# Altium schematic sheet hv_mux_tr_sw.SchDoc: BioGAP WULPUS-pro shield
size A3; DrawnBy: IIS; Revision: 1.0.0; SheetNumber: 5; SheetTotal: 8
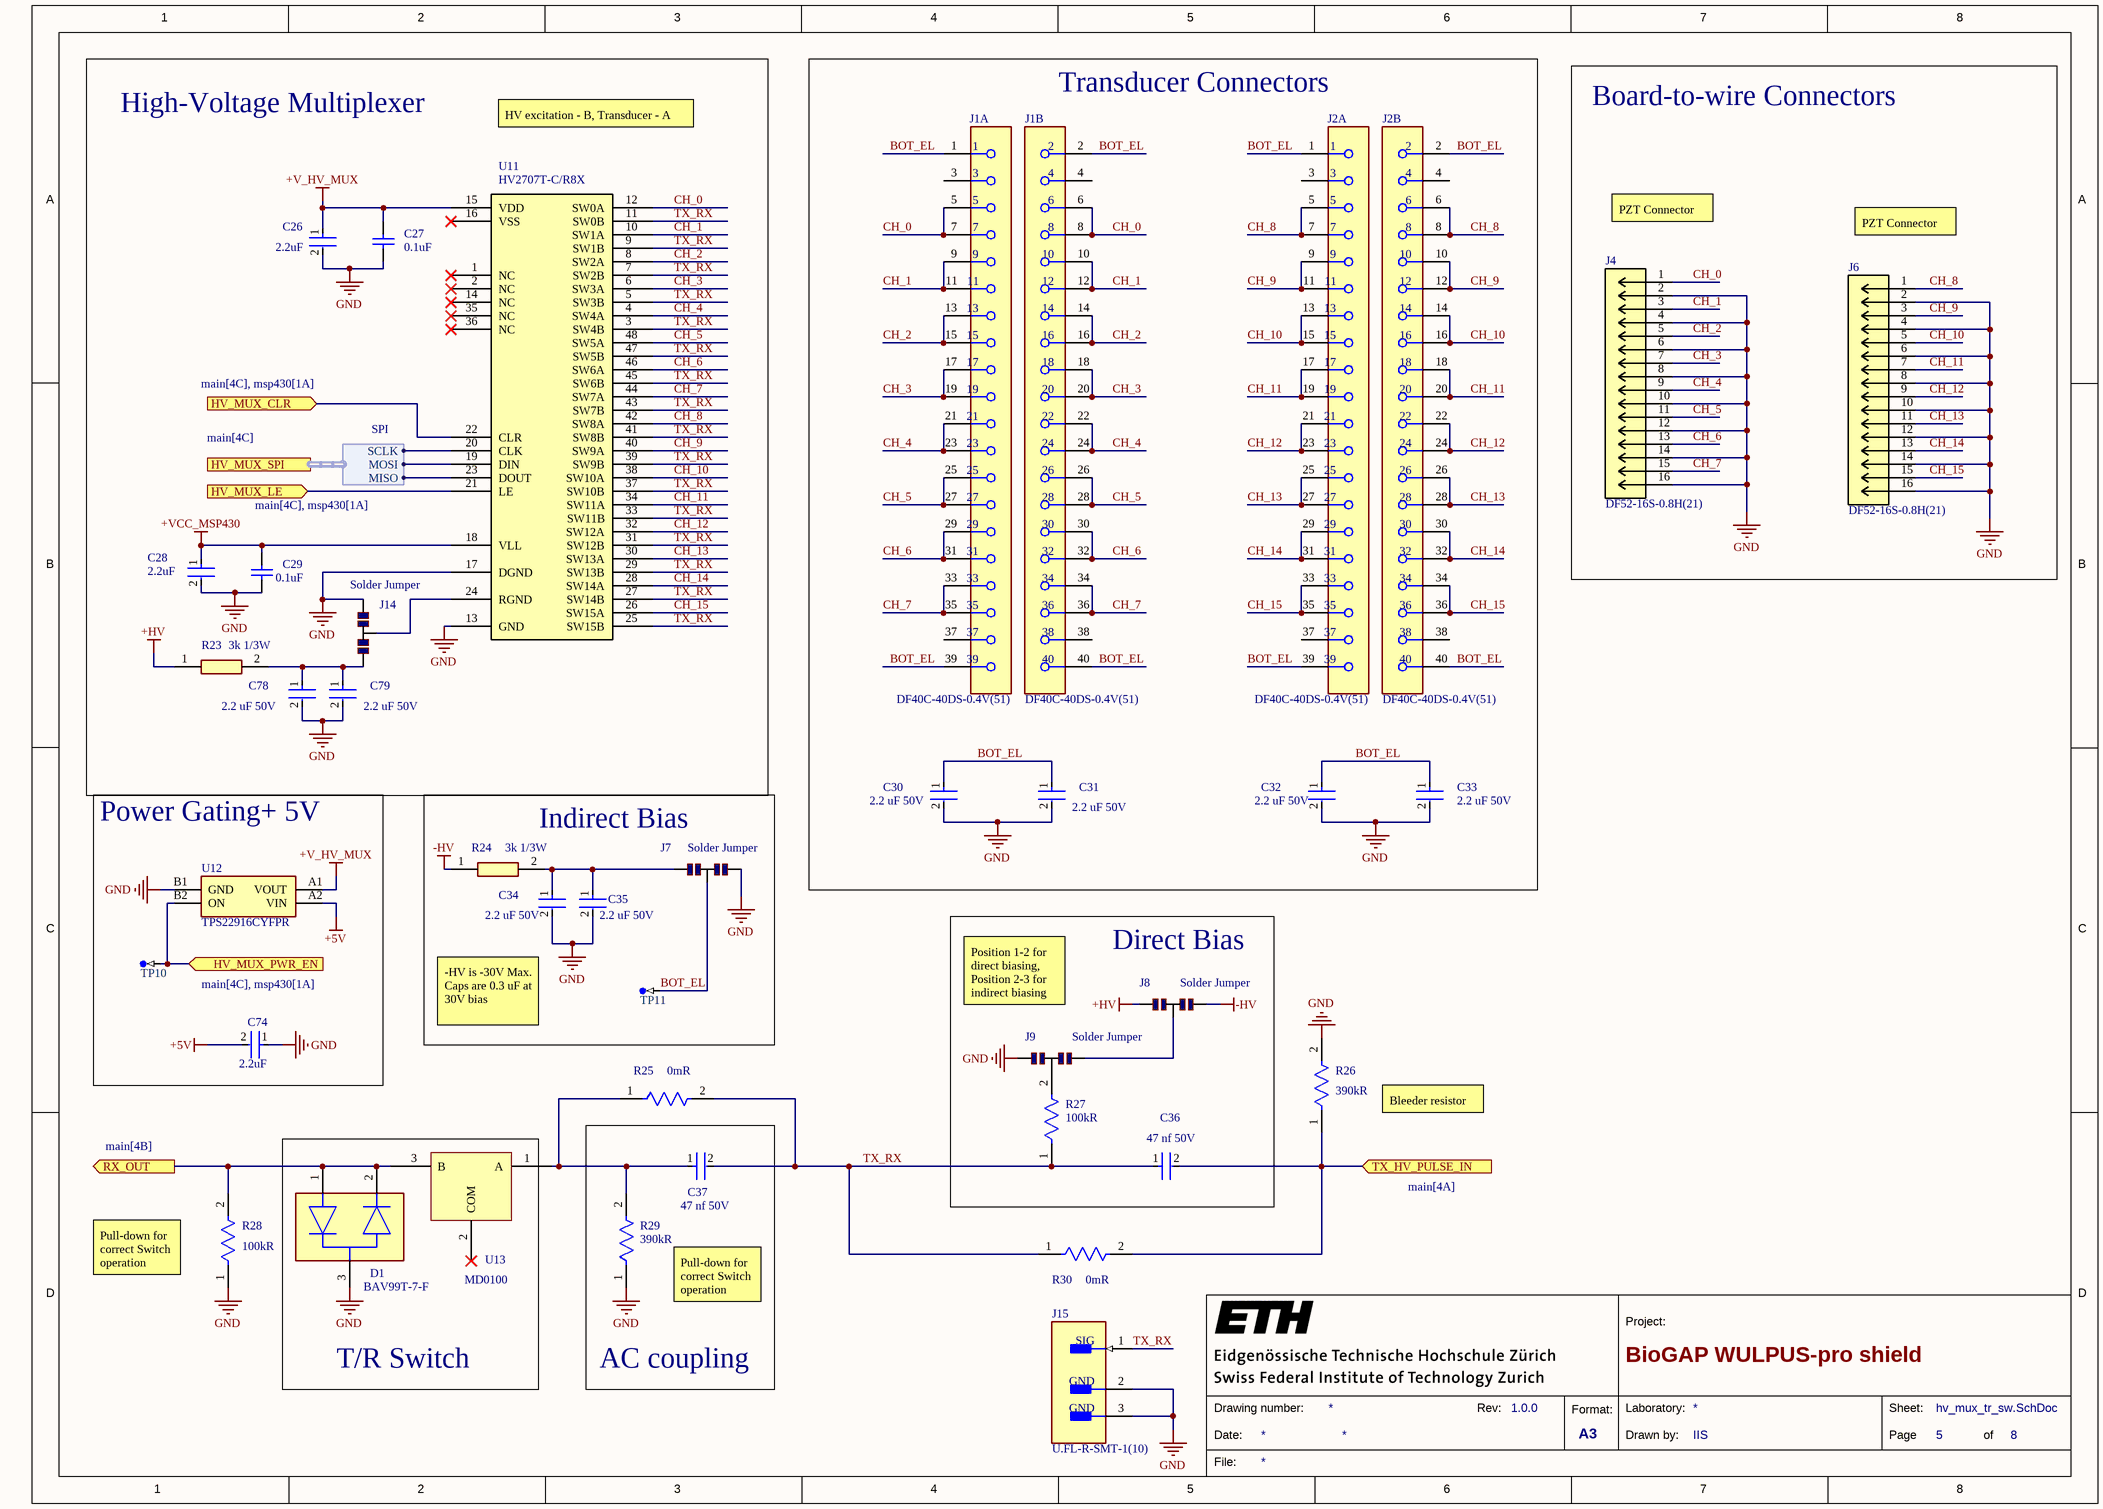
[diagram p0: hv_mux_tr_sw.SchDoc]

## Parts
C26  Capacitance: 2.2uF  [FP-C1005-050-0_15-0_1-MFG]  (hidden comment: C1005X7S1A225K050BC)
C27  Capacitance: 0.1uF  [CAPC1005X55X30LL05T10]  (hidden comment: C0402C104K4RACTU)
C28  Capacitance: 2.2uF  [FP-C1005-050-0_15-0_1-MFG]  (hidden comment: C1005X7S1A225K050BC)
C29  Capacitance: 0.1uF  [CAPC1005X55X30LL05T10]  (hidden comment: C0402C104K4RACTU)
C30  Capacitance: 2.2 uF 50V  [FP-GRM188-0_2-IPC_B]  (hidden comment: GRM188R61H225ME11)
C31  Capacitance: 2.2 uF 50V  [FP-GRM188-0_2-IPC_B]  (hidden comment: GRM188R61H225ME11)
C32  Capacitance: 2.2 uF 50V  [FP-GRM188-0_2-IPC_B]  (hidden comment: GRM188R61H225ME11)
C33  Capacitance: 2.2 uF 50V  [FP-GRM188-0_2-IPC_B]  (hidden comment: GRM188R61H225ME11)
C34  Capacitance: 2.2 uF 50V  [FP-GRM188-0_2-IPC_B]  (hidden comment: GRM188R61H225ME11)
C35  Capacitance: 2.2 uF 50V  [FP-GRM188-0_2-IPC_B]  (hidden comment: GRM188R61H225ME11)
C36  Capacitance: 47 nf 50V  [FP-GRM155-0_05-IPC_C]  (hidden comment: GRM155R71H473ME14D)
C37  Capacitance: 47 nf 50V  [FP-GRM155-0_05-IPC_C]  (hidden comment: GRM155R71H473ME14D)
C74  Capacitance: 2.2uF  [FP-C1005-050-0_15-0_1-MFG]  (hidden comment: C1005X7S1A225K050BC)
C78  Capacitance: 2.2 uF 50V  [FP-GRM188-0_2-IPC_B]  (hidden comment: GRM188R61H225ME11)
C79  Capacitance: 2.2 uF 50V  [FP-GRM188-0_2-IPC_B]  (hidden comment: GRM188R61H225ME11)
D1  BAV99T-7-F  [FP-SOT523-MFG]
J1  DF40C-40DS-0.4V(51)  [FP-DF40C-40DS-0_4V_51-MFG]  (parts A,B of 2)
J2  DF40C-40DS-0.4V(51)  [FP-DF40C-40DS-0_4V_51-MFG]  (parts A,B of 2)
J4  DF52-16S-0.8H(21)  [CONN_DF52-16S-0.8H(21)_HIR]
J6  DF52-16S-0.8H(21)  [CONN_DF52-16S-0.8H(21)_HIR]
J7  Solder Jumper  [Jumper 3 pins]  (no BOM)
J8  Solder Jumper  [Jumper 3 pins]  (no BOM)
J9  Solder Jumper  [Jumper 3 pins]  (no BOM)
J14  Solder Jumper  [Jumper 3 pins]  (no BOM)
J15  U.FL-R-SMT-1(10)  [FP-U_FL-R-SMT-1_10-MFG]
R23  Res: 3k 1/3W  [ERJP03_PA3_(0603)]  (hidden comment: ERJ-PA3J302V)
R24  Res: 3k 1/3W  [ERJP03_PA3_(0603)]  (hidden comment: ERJ-PA3J302V)
R25  Resistance: 0mR  [FP-CRCW0402-e3-IPC_C]  (hidden comment: CRCW04020000Z0ED)
R26  Resistance: 390kR  [FP-RC1005-MFG]  (hidden comment: RC1005F394CS)
R27  Resistance: 100kR  [FP-ERJ2RK-IPC_C]  (hidden comment: ERJ-2RKF1003X)
R28  Resistance: 100kR  [FP-ERJ2RK-IPC_C]  (hidden comment: ERJ-2RKF1003X)
R29  Resistance: 390kR  [FP-RC1005-MFG]  (hidden comment: RC1005F394CS)
R30  Resistance: 0mR  [FP-CRCW0402-e3-IPC_C]  (hidden comment: CRCW04020000Z0ED)
TP10  TP-SM-C-100  [TP-SM-C-100]  (value not drawn)  (no BOM)
TP11  TP-SM-C-100  [TP-SM-C-100]  (value not drawn)  (no BOM)
U11  HV2707T-C/R8X  [LQFP48_7X7MC_MCH]
U12  TPS22916CYFPR  [BGA4C40P2X2_78X78X50]
U13  MD0100  [AMP_PHA-1+]

## Blocks framed on the sheet
High-Voltage Multiplexer: C26-C29 C78 C79 J14 R23 U11
Transducer Connectors: C30-C33 J1 J2
Board-to-wire Connectors: J4 J6
Power Gating+ 5V: C74 TP10 U12
Indirect Bias: C34 C35 J7 R24 TP11
Direct Bias: C36 J8 J9 R27
T/R Switch: D1 U13
AC coupling: C37 R29

## Ports
HV_MUX_CLR (in, see main[4C], msp430[1A]), HV_MUX_LE (in, see main[4C], msp430[1A]), HV_MUX_PWR_EN (in, see main[4C], msp430[1A]), HV_MUX_SPI (harness SPI, see main[4C]), RX_OUT (out, see main[4B]), TX_HV_PULSE_IN (in, see main[4A])

## Harnesses
SPI: SCLK, MOSI, MISO

## Nets
+5V: C74.2 U12.A2(VIN)
+HV: J8.1 R23.1
+V_HV_MUX: C26.1 C27.2 U11.15(VDD) U12.A1(VOUT)
+VCC_MSP430: C28.1 C29.2 U11.18(VLL)
-HV: J8.3 R24.1
GND: C26.2 C27.1 C28.2 C29.1 C30.2 C31.2 C32.2 C33.2 C34.2 C35.2 C74.1 C78.2 C79.2 D1.3 J4.2 J4.4 J4.6 J4.8 J4.10 J4.12 J4.14 J4.16 J6.2 J6.4 J6.6 J6.8 J6.10 J6.12 J6.14 J6.16 J7.3 J9.1 J14.3 J15.2(GND) J15.3(GND) R26.2 R28.1 R29.1 U11.13(GND) U11.17(DGND) U12.B1(GND)
BOT_EL: C30.1 C31.1 C32.1 C33.1 J1.1 J1.2 J1.39 J1.40 J2.1 J2.2 J2.39 J2.40 J7.2 TP11.1
CH_0: J1.5 J1.6 J1.7 J1.8 J4.1 U11.12(SW0A)
CH_1: J1.9 J1.10 J1.11 J1.12 J4.3 U11.10(SW1A)
CH_2: J1.13 J1.14 J1.15 J1.16 J4.5 U11.8(SW2A)
CH_3: J1.17 J1.18 J1.19 J1.20 J4.7 U11.6(SW3A)
CH_4: J1.21 J1.22 J1.23 J1.24 J4.9 U11.4(SW4A)
CH_5: J1.25 J1.26 J1.27 J1.28 J4.11 U11.48(SW5A)
CH_6: J1.29 J1.30 J1.31 J1.32 J4.13 U11.46(SW6A)
CH_7: J1.33 J1.34 J1.35 J1.36 J4.15 U11.44(SW7A)
CH_8: J2.5 J2.6 J2.7 J2.8 J6.1 U11.42(SW8A)
CH_9: J2.9 J2.10 J2.11 J2.12 J6.3 U11.40(SW9A)
CH_10: J2.13 J2.14 J2.15 J2.16 J6.5 U11.38(SW10A)
CH_11: J2.17 J2.18 J2.19 J2.20 J6.7 U11.34(SW11A)
CH_12: J2.21 J2.22 J2.23 J2.24 J6.9 U11.32(SW12A)
CH_13: J2.25 J2.26 J2.27 J2.28 J6.11 U11.30(SW13A)
CH_14: J2.29 J2.30 J2.31 J2.32 J6.13 U11.28(SW14A)
CH_15: J2.33 J2.34 J2.35 J2.36 J6.15 U11.26(SW15A)
HV_MUX_CLR: U11.22(CLR) ; port HV_MUX_CLR
HV_MUX_LE: U11.21(LE) ; port HV_MUX_LE
HV_MUX_PWR_EN: TP10.1 U12.B2(ON) ; port HV_MUX_PWR_EN
RX_OUT: D1.1 D1.2 R28.2 U13.3(B) ; port RX_OUT
TX_HV_PULSE_IN: C36.2 R26.1 R30.2 ; port TX_HV_PULSE_IN
TX_RX: C36.1 C37.2 J15.1(SIG) R25.2 R27.1 R30.1 U11.3(SW4B) U11.5(SW3B) U11.7(SW2B) U11.9(SW1B) U11.11(SW0B) U11.25(SW15B) U11.27(SW14B) U11.29(SW13B) U11.31(SW12B) U11.33(SW11B) U11.37(SW10B) U11.39(SW9B) U11.41(SW8B) U11.43(SW7B) U11.45(SW6B) U11.47(SW5B)
NetC34_1: C34.1 C35.1 J7.1 R24.2
NetC37_1: C37.1 R25.1 R29.2 U13.1(A)
NetC78_1: C78.1 C79.1 J14.1 R23.2
NetJ8_2: J8.2 J9.3
NetJ9_2: J9.2 R27.2
NetJ14_2: J14.2 U11.24(RGND)
NetU11_19: U11.19(DIN) ; port HV_MUX_SPI.MOSI
NetU11_20: U11.20(CLK) ; port HV_MUX_SPI.SCLK
NetU11_23: U11.23(DOUT) ; port HV_MUX_SPI.MISO

Not connected (* = marked no-connect by the designer): J1 3 4 37 38; J2 3 4 37 38; U11 1(NC)* 2(NC)* 14(NC)* 16(VSS)* 35(NC)* 36(NC)*; U13 2(COM)*

## Notes on the sheet
- HV excitation - B, Transducer - A
- PZT Connector
- -HV is -30V Max. Caps are 0.3 uF at 30V bias
- Position 1-2 for direct biasing, Position 2-3 for indirect biasing
- Bleeder resistor
- (near R28) Pull-down for correct Switch operation
- (near R29) Pull-down for correct Switch operation
- 1
- 2
- 3
- 4
- 5
- 6
- 7
- 8
- A
- B
- C
- D
- Project:
- Date:
- Drawing number:
- Rev:
- Format:
- A3
- Drawn by:
- Laboratory:
- Page
- Sheet:
- of
- File:

## Library data of the parts
C26 C28 C74 = CMP-08246-004344-1: Dielectric: X7S; Dielectric Material: Ceramic; Voltage Rating: 10V; Tolerance: 10%; Mount: Surface Mount; Height: 0.5mm; Package Quantity: 1; Depth: 0.5mm; RoHS Compliant: Yes; Length: 1mm; Thickness: 0.022inch; Packaging: Tape and Reel; Case Code (Imperial): 0402; Resistor Type: Ceramic; Case/Package: 0402; Min Operating Temperature: -55°C; Series: C; Weight: 2.3E-05oz; Width: 0.02inch; Voltage Rating (DC): 10V; Case Code (Metric): 1005; Max Operating Temperature: 125°C; Termination: SMD/SMT; Lead Free: Lead Free
C27 C29 = CMP-0001-00074-2: Manufacturer: Kemet; Part Number: C0402C104K4RACTU
C30-C35 C78 C79 = CMP-06035-000704-1: Voltage Rating (DC): 50V; Dielectric: X5R; Tolerance: 20%; Weight: 0.000222oz; Min Operating Temperature: -55°C; Case Code (Imperial): 0603; Thickness: 0.039inch; Height: 0.8mm; Termination: SMD/SMT; Resistor Type: Ceramic; Case/Package: 0603; Package Quantity: 4000; Length: 0.063inch; Lead Free: Lead Free; Max Operating Temperature: 85°C; Packaging: Tape and Reel; Width: 0.031inch; Voltage Rating: 50V; Mount: Surface Mount; Case Code (Metric): 1608
C36 C37 = CMP-06035-054161-1: Tolerance: 20%; Voltage Rating (DC): 50V; Dielectric: X7R; Termination: SMD/SMT; Package Quantity: 10000; Min Operating Temperature: -55°C; Height: 0.5mm; Case Code (Imperial): 0402; Resistor Type: Ceramic; Case Code (Metric): 1005; Mount: Surface Mount; Case/Package: 0402; Packaging: Tape and Reel; Thickness: 0.022inch; Max Operating Temperature: 125°C; Weight: 0.000212oz; Width: 0.5mm; Length: 0.039inch; Voltage Rating: 50V
D1 = CMP-12791-000024-1: DIODE ARRAY GP 85V 75MA SOT523; Manufacturer: Diodes Inc.; Capacitance: 1.5pF; Value: 1.5pF; Standoff Height: 0mm; Peak Reverse Current: 2uA; Max Surge Forward Current: 0.5A; Max Junction Temp: +150°C; Device Class L1: Discrete Semiconductors; Automotive: No; Temperature: -65°C to +150°C; ComponentLink2Description: Datasheet; Package: SOT523; Manufacturer Part Number: BAV99T-7-F; Forward Current: 75mA; Max Repetitive Reverse Voltage: 85V; Device Class L3: Rectifier Diodes; Octopart: https://octopart.com/bav99t-7-f-diodes+inc.-326340; ComponentLink2URL: https://www.diodes.com/assets/Datasheets/ds30260.pdf; Lead Free: Yes; Digikey Description: DIODE ARRAY GP 85V 75MA SOT523; Reverse Voltage: 85V; Footprint Url: https://www.diodes.com/assets/Package-Files/SOT523.pdf; Category: Diode; RoHS: TRUE; Mouser Description: BAV99T Series 4 A 85 V 150 mW Surface Mount Fast Switching Diode - SOT-523; Device Class L2: Diodes; Height: 0.9mm; Temperature Range Low: -65°C; Temperature Range High: +150°C
J1 J2 = CMP-11605-000009-1: CONN RCPT 40POS SMD GOLD; Manufacturer: Hirose; Current Rating: 0.3A; Standoff Height: 0mm; Voltage Rating: 30V; Conn Gender: Female; Is Female: yes; Conn Orientation: Vertical; Pitch: 0.4mm; Number Of Contacts: 40; Manufacturer Part Number: DF40C-40DS-0.4V(51); Device Class L2: Board to Board Connectors; ComponentLink2URL: https://www.hirose.com/product/document?clcode=CL0684-4008-7-51&productname=DF40C-40DS-0.4V(51)&series=DF40&documenttype=SpecSheet&lang=en&documentid=0000427780; Contact Material: Gold,Nickel; Lead Free: Yes; Temperature: -35°C to +85°C; Number Of Rows: 2; Footprint Url: https://www.hirose.com/product/document?clcode=CL0684-4008-7-51&productname=DF40C-40DS-0.4V(51)&series=DF40&documenttype=2DDrawing&lang=en&documentid=0001001229; ComponentLink2Description: Datasheet; Category: Conn; Temperature Range High: +85°C; Device Class L1: Connectors; Package: 0; Digikey Description: CONN RCPT 40POS SMD GOLD; Device Class L3: unset; Height: 1.65mm; Octopart: https://octopart.com/df40c-40ds-0.4v%2851%29-hirose-19073526; RoHS: TRUE; Temperature Range Low: -35°C; Automotive: No
J4 J6 = DF52-16S-0.8H(21): No Description Available; Mfr_Name: Hirose; Copyright: Copyright (C) 2022 Ultra Librarian. All rights reserved.; Manufacturer_Part_Number: DF52-16S-0.8H(21); RefDes: RefDes; Type: DEV
J7-J9 J14 = CMP-00467-6: Solder Jumper 3 Pads; Technology: SMT
J15 = CMP-2000-05152-3: CONN U.FL RCPT STR 50 OHM SMD; Max Frequency: 6GHz; Connector Type: Coaxial; Body Plating: Silver; Body Material: Bronze; Impedance: 50R; Dielectric Material: Polymer; Insulation Resistance: 500MR; Gender: Male; Packaging: Cut Tape; Length: 3mm; Package Quantity: 2500; Termination: Solder; Lead Free: Lead Free; Series: U.FL; Min Operating Temperature: -40°C; Fastening Type: Snap; Contact Material: Brass; Orientation: Straight; Wire/Cable Type: Coaxial; Frequency: 6GHz; Contact Plating: Gold; Depth: 3.1mm; Weight: 0.001764oz; Max Operating Temperature: 90°C; Radiation Hardening: No; REACH SVHC: No SVHC; Mount: Surface Mount; Housing Color: Beige
R23 = ERJ-PA3J302V: Resistor; Manufacturer_Name: Panasonic; Datasheet Link: https://industrial.panasonic.com/cdbs/www-data/pdf/RDO0000/AOA0000C331.pdf; Height: 0.55mm; Manufacturer_Part_Number: ERJ-PA3J302V; Mouser Part Number: 667-ERJ-PA3J302V; Mouser Price/Stock: https://www.mouser.co.uk/ProductDetail/Panasonic/ERJ-PA3J302V?qs=BzJM0faLVqU1ZJAPCjWnWA%3D%3D
R24 = ERJ-PA3J302V: Manufacturer_Name: Panasonic; Datasheet Link: https://industrial.panasonic.com/cdbs/www-data/pdf/RDO0000/AOA0000C331.pdf; Height: 0.55mm; Manufacturer_Part_Number: ERJ-PA3J302V; Mouser Part Number: 667-ERJ-PA3J302V; Mouser Price/Stock: https://www.mouser.co.uk/ProductDetail/Panasonic/ERJ-PA3J302V?qs=BzJM0faLVqU1ZJAPCjWnWA%3D%3D
R25 R30 = CMP-2002-08122-2: Tolerance: 5%; Max Power Dissipation: 63mW; Voltage Rating: 50V; Temperature Coefficient: 100ppm/°C; Contact Plating: Tin; Height: 0.35mm; Radiation Hardening: No; Features: Automotive AEC-Q200; Composition: Thick Film; Width: 0.5mm; Weight: 2.3E-05oz; Termination: SMD/SMT; Packaging: Tape and Reel; Mount: Surface Mount; Case Code (Metric): 1005; Military Standard: Not; Min Operating Temperature: -55°C; Number of Terminations: 2; Package Quantity: 1; Case Code (Imperial): 0402; Depth: 0.5mm; Max Operating Temperature: 155°C; Case/Package: 0402; Power Rating: 63mW; Lead Free: Lead Free; Voltage Rating (DC): 50V; Length: 1mm
R26 R29 = CMP-13261-002896-1: Voltage Rating (DC): 50V; Tolerance: 1%; Max Power Dissipation: 63mW; Temperature Coefficient: 100ppm/°C; Lead Free: Lead Free; Case/Package: 0402; Radiation Hardening: No; Length: 0.039inch; Depth: 0.5mm; Composition: Thick Film; Number of Terminations: 2; Height: 0.016inch; Packaging: Tape and Reel; Case Code (Imperial): 0402; Width: 0.02inch; Features: Moisture Resistant; Contact Plating: Tin; Min Operating Temperature: -55°C; Max Operating Temperature: 155°C; Case Code (Metric): 1005; Military Standard: Not
R27 R28 = CMP-2002-00608-4: Voltage Rating (DC): 50V; Tolerance: 1%; Power Rating: 100mW; Temperature Coefficient: 100ppm/°C; Case/Package: 0402; Length: 1mm; Package Quantity: 1; Radiation Hardening: No; Case Code (Metric): 1005; Contact Plating: Tin; Mount: Surface Mount; Depth: 0.5mm; Max Operating Temperature: 155°C; Lead Free: Lead Free; Width: 0.5mm; Composition: Thick Film; Case Code (Imperial): 0402; Termination: SMD/SMT; Number of Pins: 2; Height: 0.35mm; Voltage Rating: 50V; Military Standard: Not; REACH SVHC: No SVHC; Packaging: Tape and Reel; Min Operating Temperature: -55°C; Max Power Dissipation: 100mW; Features: Automotive AEC-Q200; Number of Terminations: 2
TP10 TP11 = CMP-0484-00002-1: Test Point, Surface Mount, Circular, Pad Diameter 1 mm
U11 = HV2707T-C/R8X: 16-CH 200V No Hv Bias Switch (SPST), 2 Bleed Resistor 48 LQFP 7X7X1.4MM T/r Rohs Compliant: Yes; Manufacturer: Microchip; Supplier 1: Digi-Key; RoHS: Yes; Category: Decoders and Multiplexers; Stock 1: 440; Pricing 1: 1=19.01000, 25=15.84720, 100=14.65500 (USD); Manufacturer Part Number: HV2707T-C/R8X
U12 = TPS22916CYFPR: TPS22916 5.5-V, 2-A Ultra-Low Leakage Load Switch; Manufacturer_Name: Texas Instruments; Geometry.Height: 0.5mm; Manufacturer_Part_Number: TPS22916CYFPR; Arrow Part Number: TPS22916CYFPR; Arrow Price/Stock: https://www.arrow.com/en/products/tps22916cyfpr/texas-instruments?utm_currency=USD&region=nac; Datasheet Link: http://www.ti.com/lit/gpn/tps22916